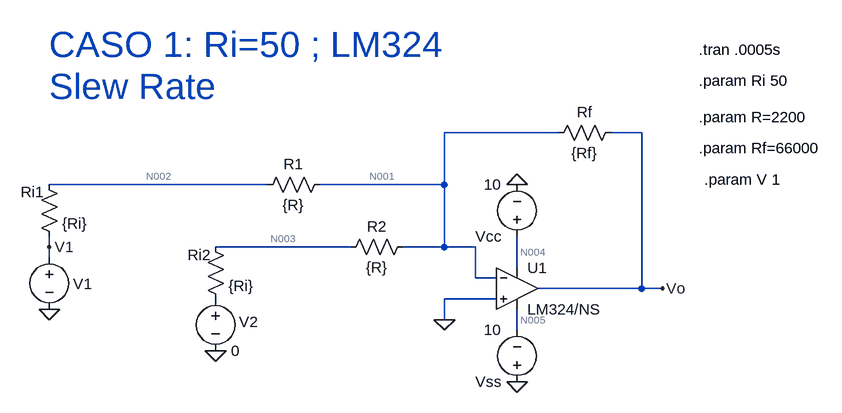
[diagram p0: schematic Caso 1.1 - LM324 - Slew Rate.asc]
Caso 1.1 - LM324 - Slew Rate.asc, the LTspice schematic file:
Version 4
SHEET 1 1152 1072
WIRE 560 352 384 352
WIRE 688 352 640 352
WIRE 112 432 -224 432
WIRE 384 432 384 352
WIRE 384 432 192 432
WIRE -224 528 -224 512
WIRE 240 528 32 528
WIRE 384 528 384 432
WIRE 384 528 320 528
WIRE 432 528 384 528
WIRE -224 544 -224 528
WIRE 496 560 496 512
WIRE 432 576 432 528
WIRE 464 576 432 576
WIRE 688 592 688 352
WIRE 688 592 528 592
WIRE 720 592 688 592
WIRE 464 608 384 608
WIRE 384 640 384 608
WIRE 496 656 496 624
FLAG -224 624 0
FLAG 32 688 0
FLAG 384 640 0
FLAG 720 592 Vo
FLAG 496 432 0
FLAG 496 736 0
FLAG -224 528 V1
SYMBOL res 208 416 R90
WINDOW 0 0 56 VBottom 2
WINDOW 3 32 56 VTop 2
SYMATTR InstName R1
SYMATTR Value {R}
SYMBOL res 336 512 R90
WINDOW 0 0 56 VBottom 2
WINDOW 3 32 56 VTop 2
SYMATTR InstName R2
SYMATTR Value {R}
SYMBOL voltage -224 528 R0
WINDOW 0 37 57 Left 2
WINDOW 123 0 0 Left 0
WINDOW 39 0 0 Left 0
WINDOW 3 -212 149 Invisible 2
SYMATTR InstName V1
SYMATTR Value PULSE(-10m 10m 50u .01p .01p .1m 0.2m 10)
SYMBOL voltage 32 592 R0
WINDOW 0 36 51 Left 2
SYMATTR InstName V2
SYMATTR Value 0
SYMBOL res 656 336 R90
WINDOW 0 0 56 VBottom 2
WINDOW 3 32 56 VTop 2
SYMATTR InstName Rf
SYMATTR Value {Rf}
SYMBOL voltage 496 752 R180
WINDOW 123 0 0 Left 0
WINDOW 39 0 0 Left 0
SYMATTR InstName Vss
SYMATTR Value 10
SYMBOL voltage 496 528 R180
WINDOW 123 0 0 Left 0
WINDOW 39 0 0 Left 0
SYMATTR InstName Vcc
SYMATTR Value 10
SYMBOL res -240 416 R0
WINDOW 0 -28 27 Left 2
SYMATTR InstName Ri1
SYMATTR Value {Ri}
SYMBOL res 16 512 R0
WINDOW 0 -27 28 Left 2
SYMATTR InstName Ri2
SYMATTR Value {Ri}
SYMBOL ZZZ\\OpAmp\\LM324 496 592 R0
SYMATTR InstName U1
TEXT 776 224 Left 2 !.tran .0005s
TEXT 776 272 Left 2 !.param Ri 50
TEXT 776 328 Left 2 !.param R=2200
TEXT 776 376 Left 2 !.param Rf=66000
TEXT 784 424 Left 2 !.param V 1
TEXT -224 216 Left 5 ;CASO 1: Ri=50 ; LM324
TEXT -224 280 Left 5 ;Slew Rate

The netlist it stands for:
* Caso 1.1 - LM324 - Slew Rate.asc
R1 N001 N002 {R}
R2 N001 N003 {R}
V1 V1 0 PULSE(-10m 10m 50u .01p .01p .1m 0.2m 10)
V2 P001 0 0
Rf Vo N001 {Rf}
Vss 0 N005 10
Vcc N004 0 10
Ri1 N002 V1 {Ri}
Ri2 N003 P001 {Ri}
XU1 0 N001 N004 N005 Vo LM324/NS  ; pins In+ In- V+ V- OUT
.tran .0005s
.param Ri 50
.param R=2200
.param Rf=66000
.param V 1
* CASO 1: Ri=50 ; LM324
* Slew Rate
.backanno
.end

* Results of the author's LTspice run, read from the files saved beside the schematic
* Operating Point, zero values left out:
*   V(n001) = 1.996 mV
*   V(n002) = -9.733 mV
*   V(n003) = 44.35 µV
*   V(v1) = -10 mV
*   V(vo) = 409.9 mV
*   V(n005) = -10 V
*   V(n004) = 10 V
*   I(R1) = 5.332 µA
*   I(R2) = 887.1 nA
*   I(Rf) = 6.181 µA
*   I(Ri1) = 5.332 µA
*   I(Ri2) = 887.1 nA
*   I(V1) = 5.332 µA
*   I(V2) = 887.1 nA
*   I(Vss) = -75.54 µA
*   I(Vcc) = -81.81 µA
*   Ix(u1:1) = -51.95 nA
*   Ix(u1:2) = -37.96 nA
*   Ix(u1:99) = 81.81 µA
*   Ix(u1:50) = -75.54 µA
*   Ix(u1:28) = -6.181 µA
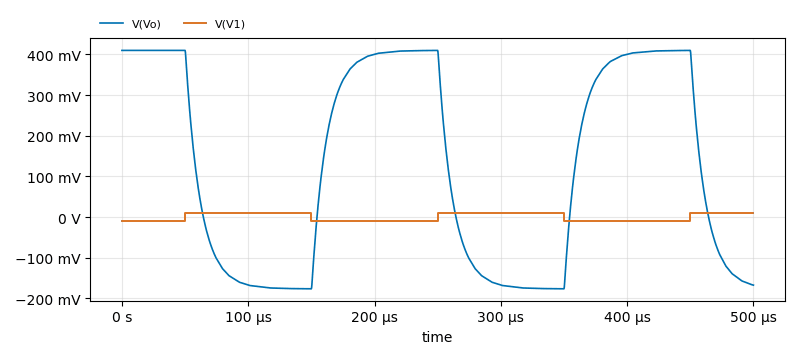
[diagram p1: Transient Analysis of Caso 1.1 - LM324 - Slew Rate.asc, plotted from the saved traces]
* Transient Analysis, 1 run:
*   V(Vo): min -176.4 mV, max 410 mV, average 130.8 mV, rms 287 mV, last -167.3 mV
*   V(V1): min -10 mV, max 10 mV, average 0 V, rms 10 mV, last 10 mV